# EAGLE design mb (EAGLE 7.7.0)
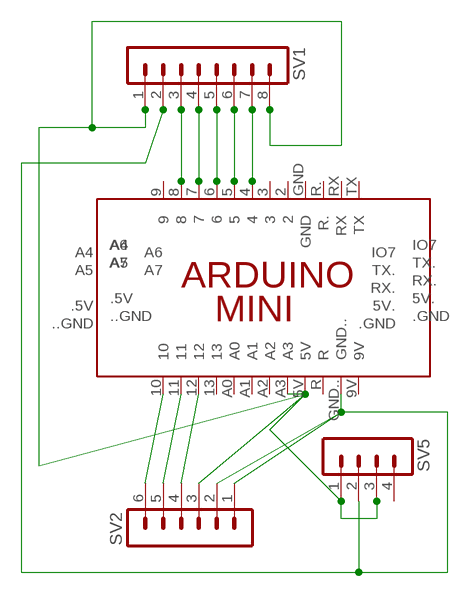
[diagram p0: schematic, sheet 1]

## Parts
PCB2  ARDUINO_MINI  [ARDUINO_MINI]
SV1  MA08-1W  [MA08-1W]
SV2  MA06-1  [MA06-1]
SV5  MA04-1  [MA04-1]

## Nets
N$1: PCB2.8 SV1.3
N$2: PCB2.7 SV1.4
N$3: PCB2.6 SV1.5
N$4: PCB2.5 SV1.6
N$5: PCB2.4 SV1.7
N$6: PCB2.5V PCB2.A3 SV1.1 SV1.8 SV2.3 SV5.1 SV5.3
N$7: PCB2.12 SV2.4
N$8: PCB2.GND.. SV1.2 SV2.1 SV2.2 SV5.2
N$9: PCB2.11 SV2.5
N$11: PCB2.10 SV2.6
Unconnected: PCB2.2 PCB2.3 PCB2.5V. PCB2.9 PCB2.9V PCB2.13 PCB2..5V PCB2...GND PCB2..GND PCB2.A0 PCB2.A1 PCB2.A2 PCB2.A4 PCB2.A5 PCB2.A6 PCB2.A7 PCB2.GND PCB2.IO7 PCB2.R PCB2.R. PCB2.RX PCB2.RX. PCB2.TX PCB2.TX. SV5.4

## Library data of the parts
PCB2 = Arduino_revC:ARDUINO_MINI: Device for representing an Arduino Mini board with a footprint in an EAGLE design. Created by Dave Young for Element14. More EAGLE documentation at: http://www.element14.com/community/community/knode/cadsoft_eagle
SV1 = con-lstb:MA08-1W: PIN HEADER; OC_FARNELL: unknown; OC_NEWARK: unknown
SV2 = con-lstb:MA06-1: PIN HEADER; OC_FARNELL: unknown; OC_NEWARK: unknown
SV5 = con-lstb:MA04-1: PIN HEADER; OC_FARNELL: unknown; OC_NEWARK: unknown

## Board
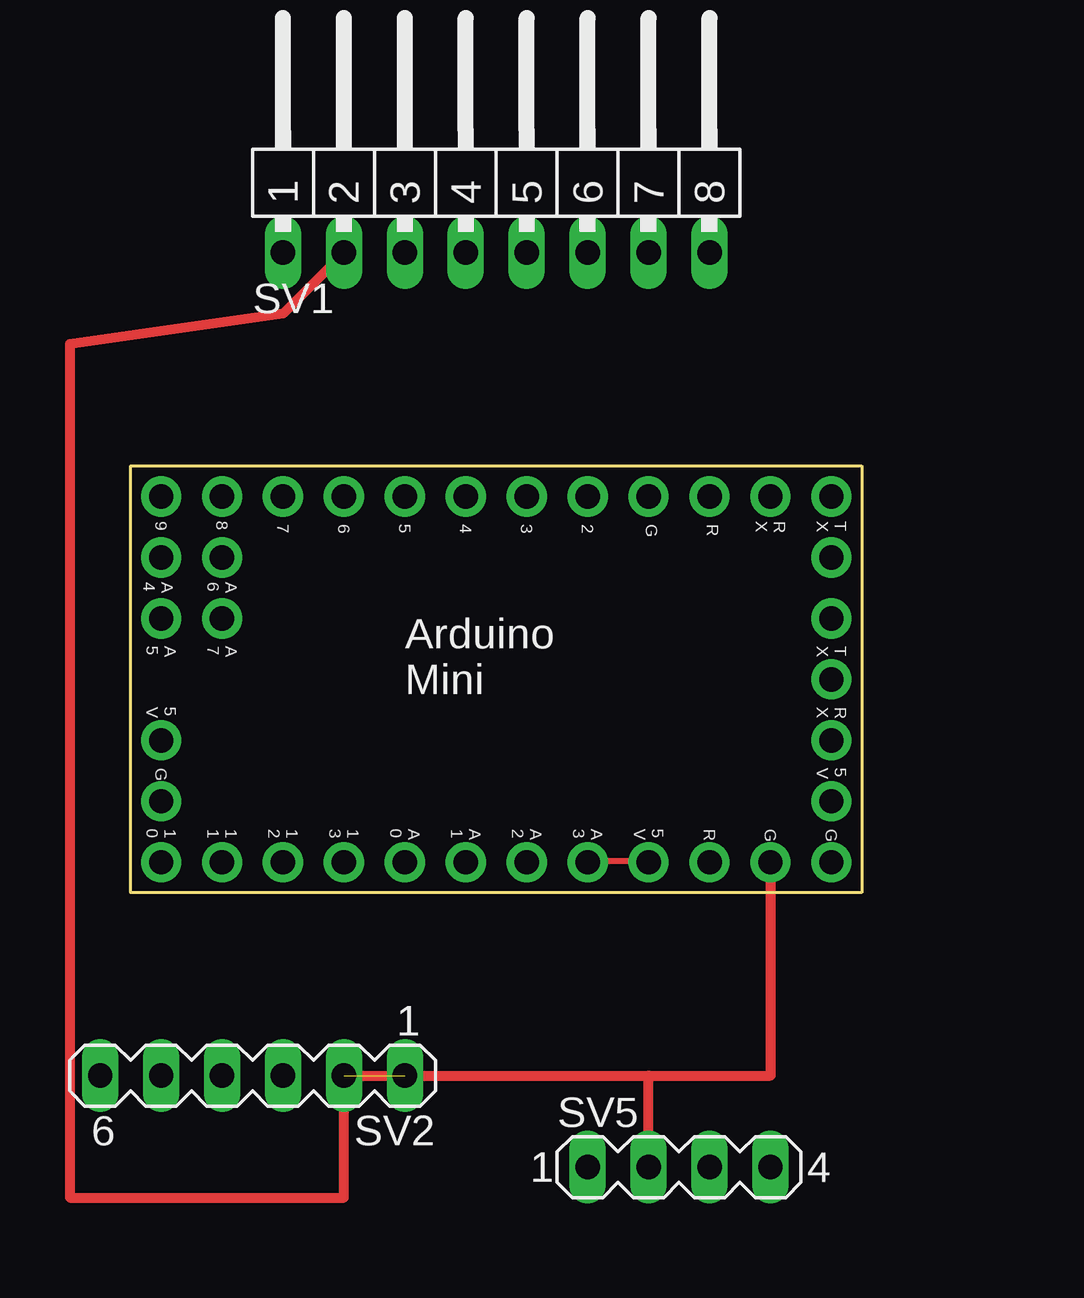
[diagram p1: board, top side]
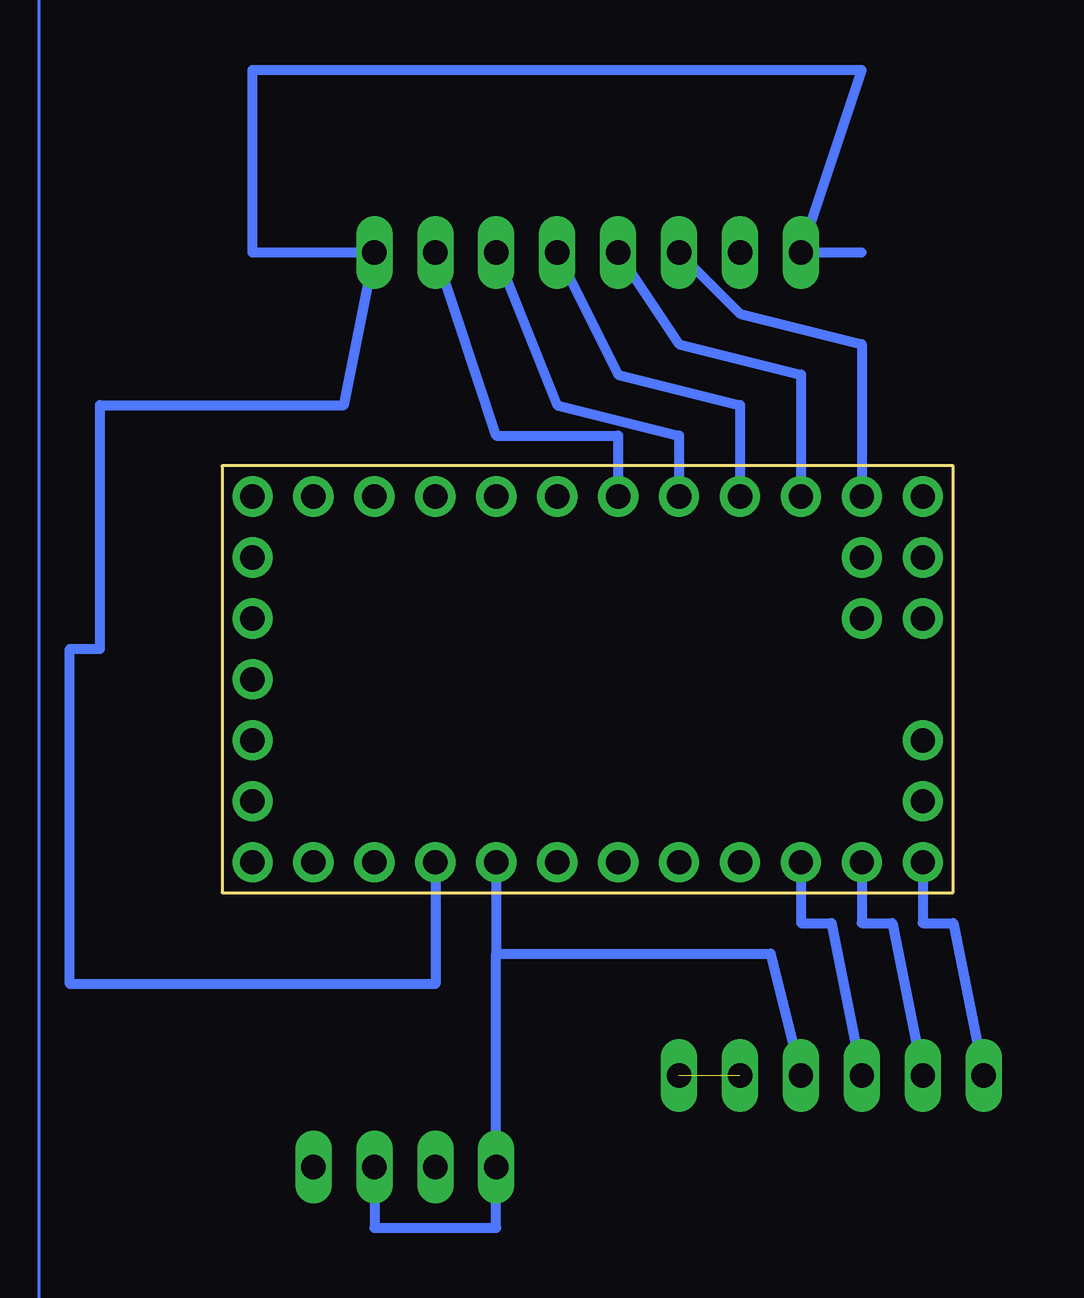
[diagram p2: board, bottom side, seen from below]

Size 30.48 x 17.78 mm. Coordinates in mm from the lower left corner, seen from the top.
Copper layers (1*16): Top 0.035mm / dielectric 1.5mm / Bottom 0.035mm
Design rules "default": minimum track width 10mil, minimum drill 24mil, track to track 8mil, track to pad 8mil, pad to pad 8mil, via to via 8mil, smd to smd 8mil, copper to edge 40mil, drill to drill 8mil, minimum pad ring 10mil, minimum via ring 8mil, stop-mask expansion 4mil, vias tented up to drill 0mil, thermal gap 10mil

### Footprints (pad centres in the part's own frame; a part is rotated, then mirrored left to right if it is on the bottom)
ARDUINO_MINI = drill 1.016 pad 1.676: 2 19.05,16.51; 3 16.51,16.51; 4 13.97,16.51; 5 11.43,16.51; 5V 21.59,1.27; 5V. 29.21,6.35; 6 8.89,16.51; 7 6.35,16.51; 8 3.81,16.51; 9 1.27,16.51; 9V 29.21,1.27; 10 1.27,1.27; 11 3.81,1.27; 12 6.35,1.27; 13 8.89,1.27; .5V 1.27,6.35; ..GND 1.27,3.81; .GND 29.21,3.81; A0 11.43,1.27; A1 13.97,1.27; A2 16.51,1.27; A3 19.05,1.27; A4 1.27,13.97; A5 1.27,11.43; A6 3.81,13.97; A7 3.81,11.43; GND 21.59,16.51; GND.. 26.67,1.27; IO7 29.21,13.97; R 24.13,1.27; R. 24.13,16.51; RX 26.67,16.51; RX. 29.21,8.89; TX 29.21,16.51; TX. 29.21,11.43
MA08-1W = drill 1.016 long: 1 -8.89,0; 2 -6.35,0; 3 -3.81,0; 4 -1.27,0; 5 1.27,0; 6 3.81,0; 7 6.35,0; 8 8.89,0
MA06-1 = drill 1.016 long: 1 -6.35,0; 2 -3.81,0; 3 -1.27,0; 4 1.27,0; 5 3.81,0; 6 6.35,0
MA04-1 = drill 1.016 long: 1 -3.81,0; 2 -1.27,0; 3 1.27,0; 4 3.81,0

### Placement (x,y rotation side)
PCB2  0,0 0 top
SV1  15.24,26.67 0 top  (outside the outline)
SV2  5.08,-7.62 180 top  (outside the outline)
SV5  22.86,-11.43 0 top  (outside the outline)

### Tracks (layer width: path | path; a pad name or v marks a point on that pad's centre or on a via)
N$1
  Bottom 0.406: SV1.3 8.89,24.13 3.81,22.86 PCB2.8
N$2
  Bottom 0.406: SV1.4 11.43,22.86 6.35,21.59 PCB2.7
N$3
  Bottom 0.406: SV1.5 13.97,21.59 8.89,20.32 PCB2.6
N$4
  Bottom 0.406: SV1.6 16.51,20.32 11.43,19.05 PCB2.5
N$5
  Bottom 0.406: SV1.7 19.05,19.05 13.97,19.05 PCB2.4
N$6
  Top 0.254: PCB2.A3 19.15,1.32 21.44,1.32 PCB2.5V
  Bottom 0.406: 3.81,26.67 SV1.1 3.81,34.29 29.21,34.29 29.21,26.67 SV1.8 25.4,20.32 35.56,20.32 35.56,10.16 36.83,10.16 36.83,-3.81 21.59,-3.81 PCB2.5V | PCB2.A3 19.05,-2.54 | 19.05,-2.54 7.62,-2.54 SV2.3 | 19.05,-2.54 SV5.1 19.05,-13.97 24.13,-13.97 SV5.3
N$7
  Bottom 0.406: PCB2.12 6.35,-1.27 5.08,-1.27 SV2.4
N$8  (1 unrouted)
  Top 0.406: SV1.2 6.35,24.13 -2.54,22.86 -2.54,-12.7 8.89,-12.7 SV2.2 21.59,-7.62 | 21.59,-7.62 26.67,-7.62 PCB2.GND.. | SV5.2 21.59,-7.62
N$9
  Bottom 0.406: PCB2.11 3.81,-1.27 2.54,-1.27 SV2.5
N$11
  Bottom 0.406: PCB2.10 1.27,-1.27 0,-1.27 SV2.6
(copper drawn outside any net)
  shapes: Bottom area x1